# EAGLE schematic imager-adc (EAGLE 6.5.0)
AUTHOR: Russ Bielawski; REV: b; TITLE: SensEye Imager/ADC Board
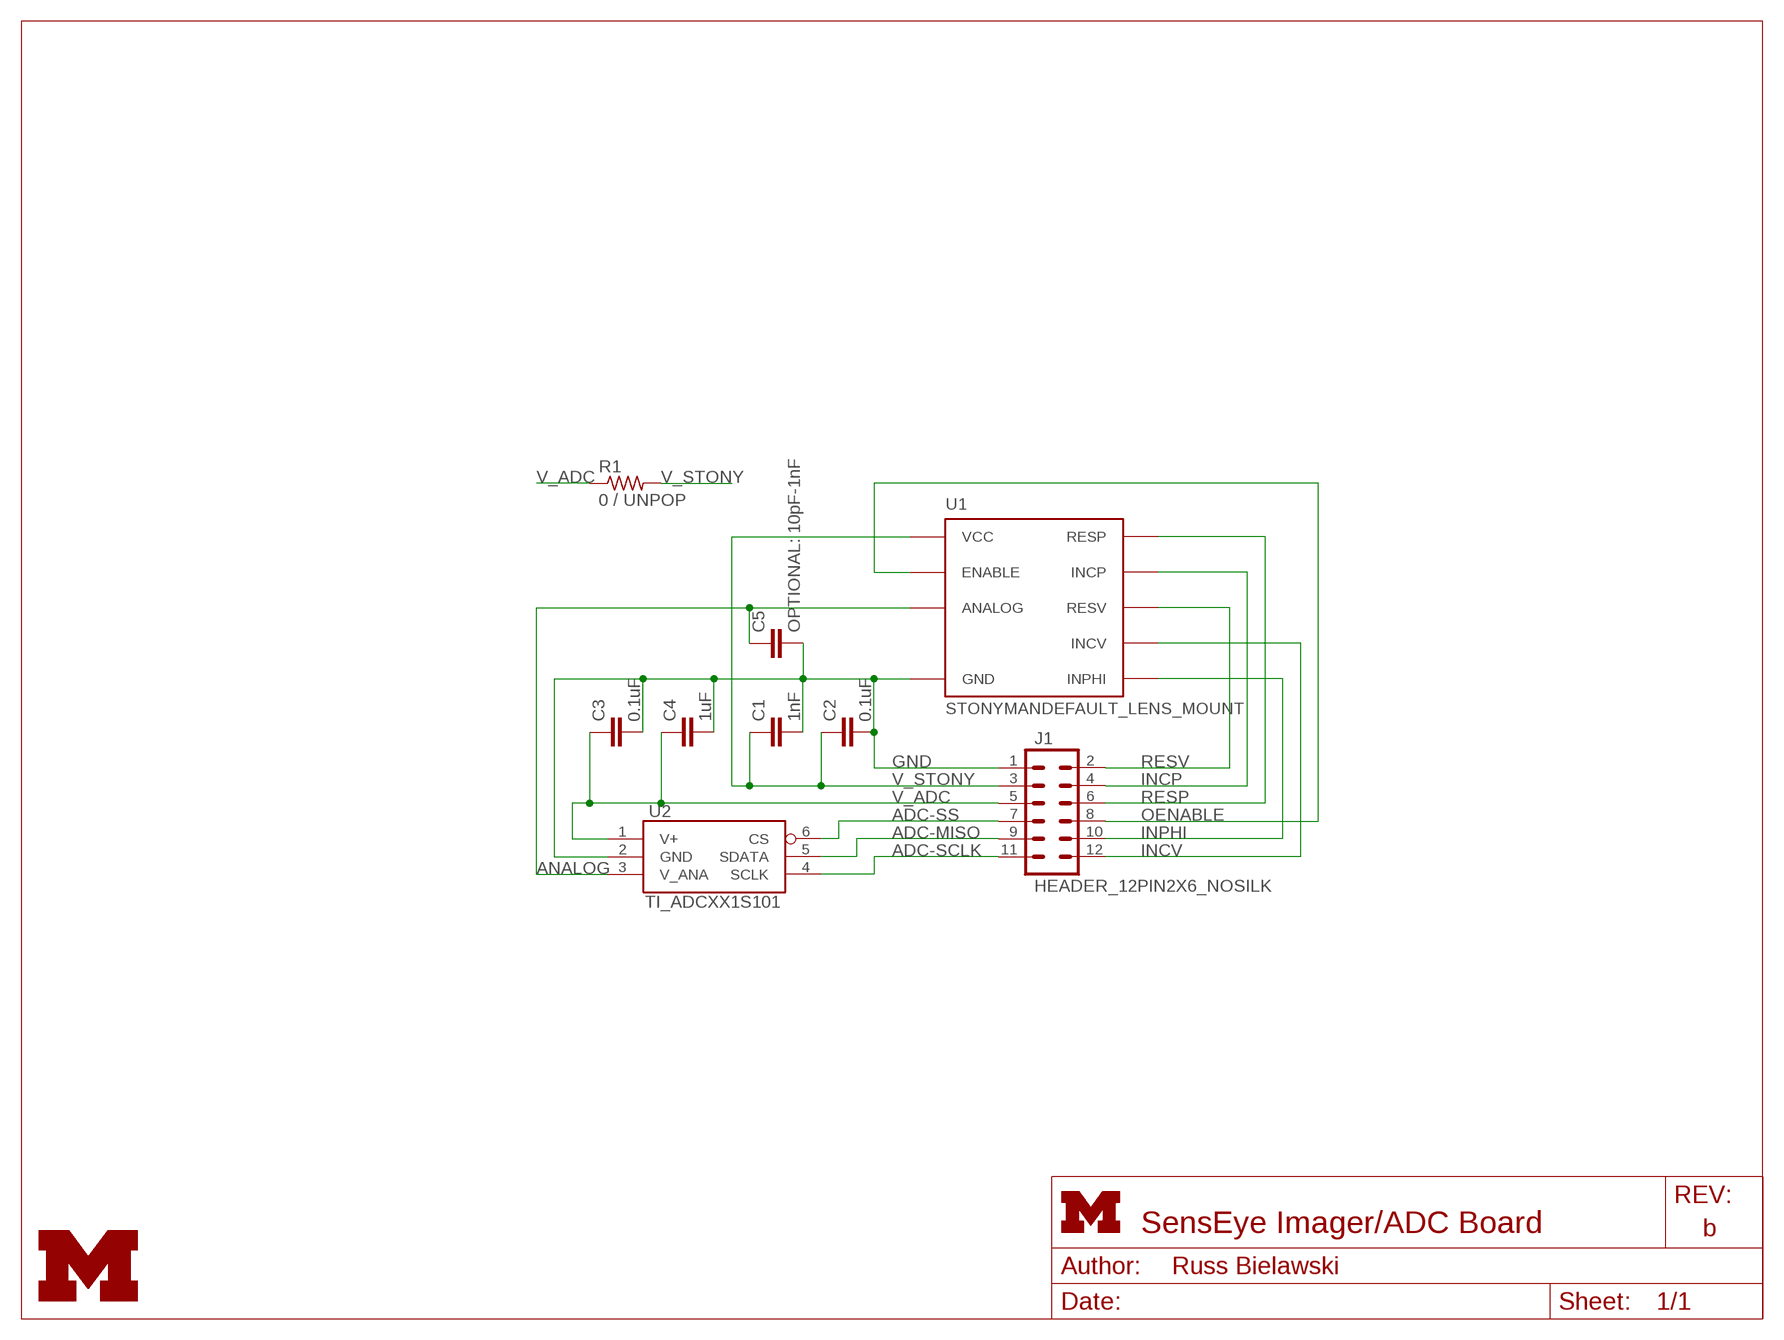
[diagram p0: schematic, sheet 1]
FRAME1 (LETTER_L): HEIGHT: 8.5in; WIDTH: 11in

## Parts
C1  1nF  C-EUC0603  [C0603]
C2  0.1uF  C-EUC0603  [C0603]
C3  0.1uF  C-EUC0603  [C0603]
C4  1uF  C-EUC0603  [C0603]
C5  OPTIONAL: 10pF-1nF  C-EUC0603  [C0603]
J1  HEADER_12PIN2X6_NOSILK  [HEADER2X6/0.05IN_NO_SILK]
R1  0 / UNPOP  R-US_R0603  [R0603]
U1  STONYMANDEFAULT_LENS_MOUNT  [STONYMAN_DEFAULT_LENS]
U2  TI_ADCXX1S101  [SOT23-6]
U$1  UMICH_SOLID_SMALL  [UMICH_SOLID_75MIL]

## Nets
ADC-MISO: J1.9 U2.5(SDATA)
ADC-SCLK: J1.11 U2.4(SCLK)
ADC-SS: J1.7 U2.6(CS)
ANALOG: C5.1 U1.P$8(ANALOG) U2.3(V_ANA)
GND: C1.2 C2.2 C3.2 C4.2 C5.2 J1.1 U1.P$1(GND) U1.P$10(GND) U2.2(GND)
INCP: J1.4 U1.P$4(INCP)
INCV: J1.12 U1.P$6(INCV)
INPHI: J1.10 U1.P$7(INPHI)
OENABLE: J1.8 U1.P$9(ENABLE)
RESP: J1.6 U1.P$3(RESP)
RESV: J1.2 U1.P$5(RESV)
V_ADC: C3.1 C4.1 J1.5 R1.1 U2.1(V+)
V_STONY: C1.1 C2.1 J1.3 R1.2 U1.P$2(VCC)

## Library data of the parts
C1 = rcl:C-EU: CAPACITOR, European symbol; DIGIKEY: 1276-1916-2-ND
C2 C3 = rcl:C-EU: CAPACITOR, European symbol; DIGIKEY: 1276-1012-2-ND
C4 = rcl:C-EU: CAPACITOR, European symbol; DIGIKEY: 1276-1243-2-ND
C5 = rcl:C-EU: CAPACITOR, European symbol; DIGIKEY: 1276-1187-6-ND
J1 = senseye:HEADER_12PIN; DIGIKEY: S9015E-06-ND; DIGIKEY-ALT: 609-3713-ND
R1 = rcl:R-US_: RESISTOR, American symbol; DIGIKEY: 1276-3510-6-ND
U1 = senseye:STONYMAN: Centeye Stonyman imager chip
U2 = senseye:TI_ADCXX1S101: Texas Instruments ADCXX1S101 (ADC081S101, ADC101S101, ADC121S101) Single Channel, 0.5 to 1.0 Msps, 8-bit, 10-bit and 12-bit A/D Converters; DIGIKEY: ADC121S101CIMF/NOPBDKR-ND
U$1 = logos:UMICH_SOLID